# Altium schematic sheet Main sheet.SchDoc
size A3
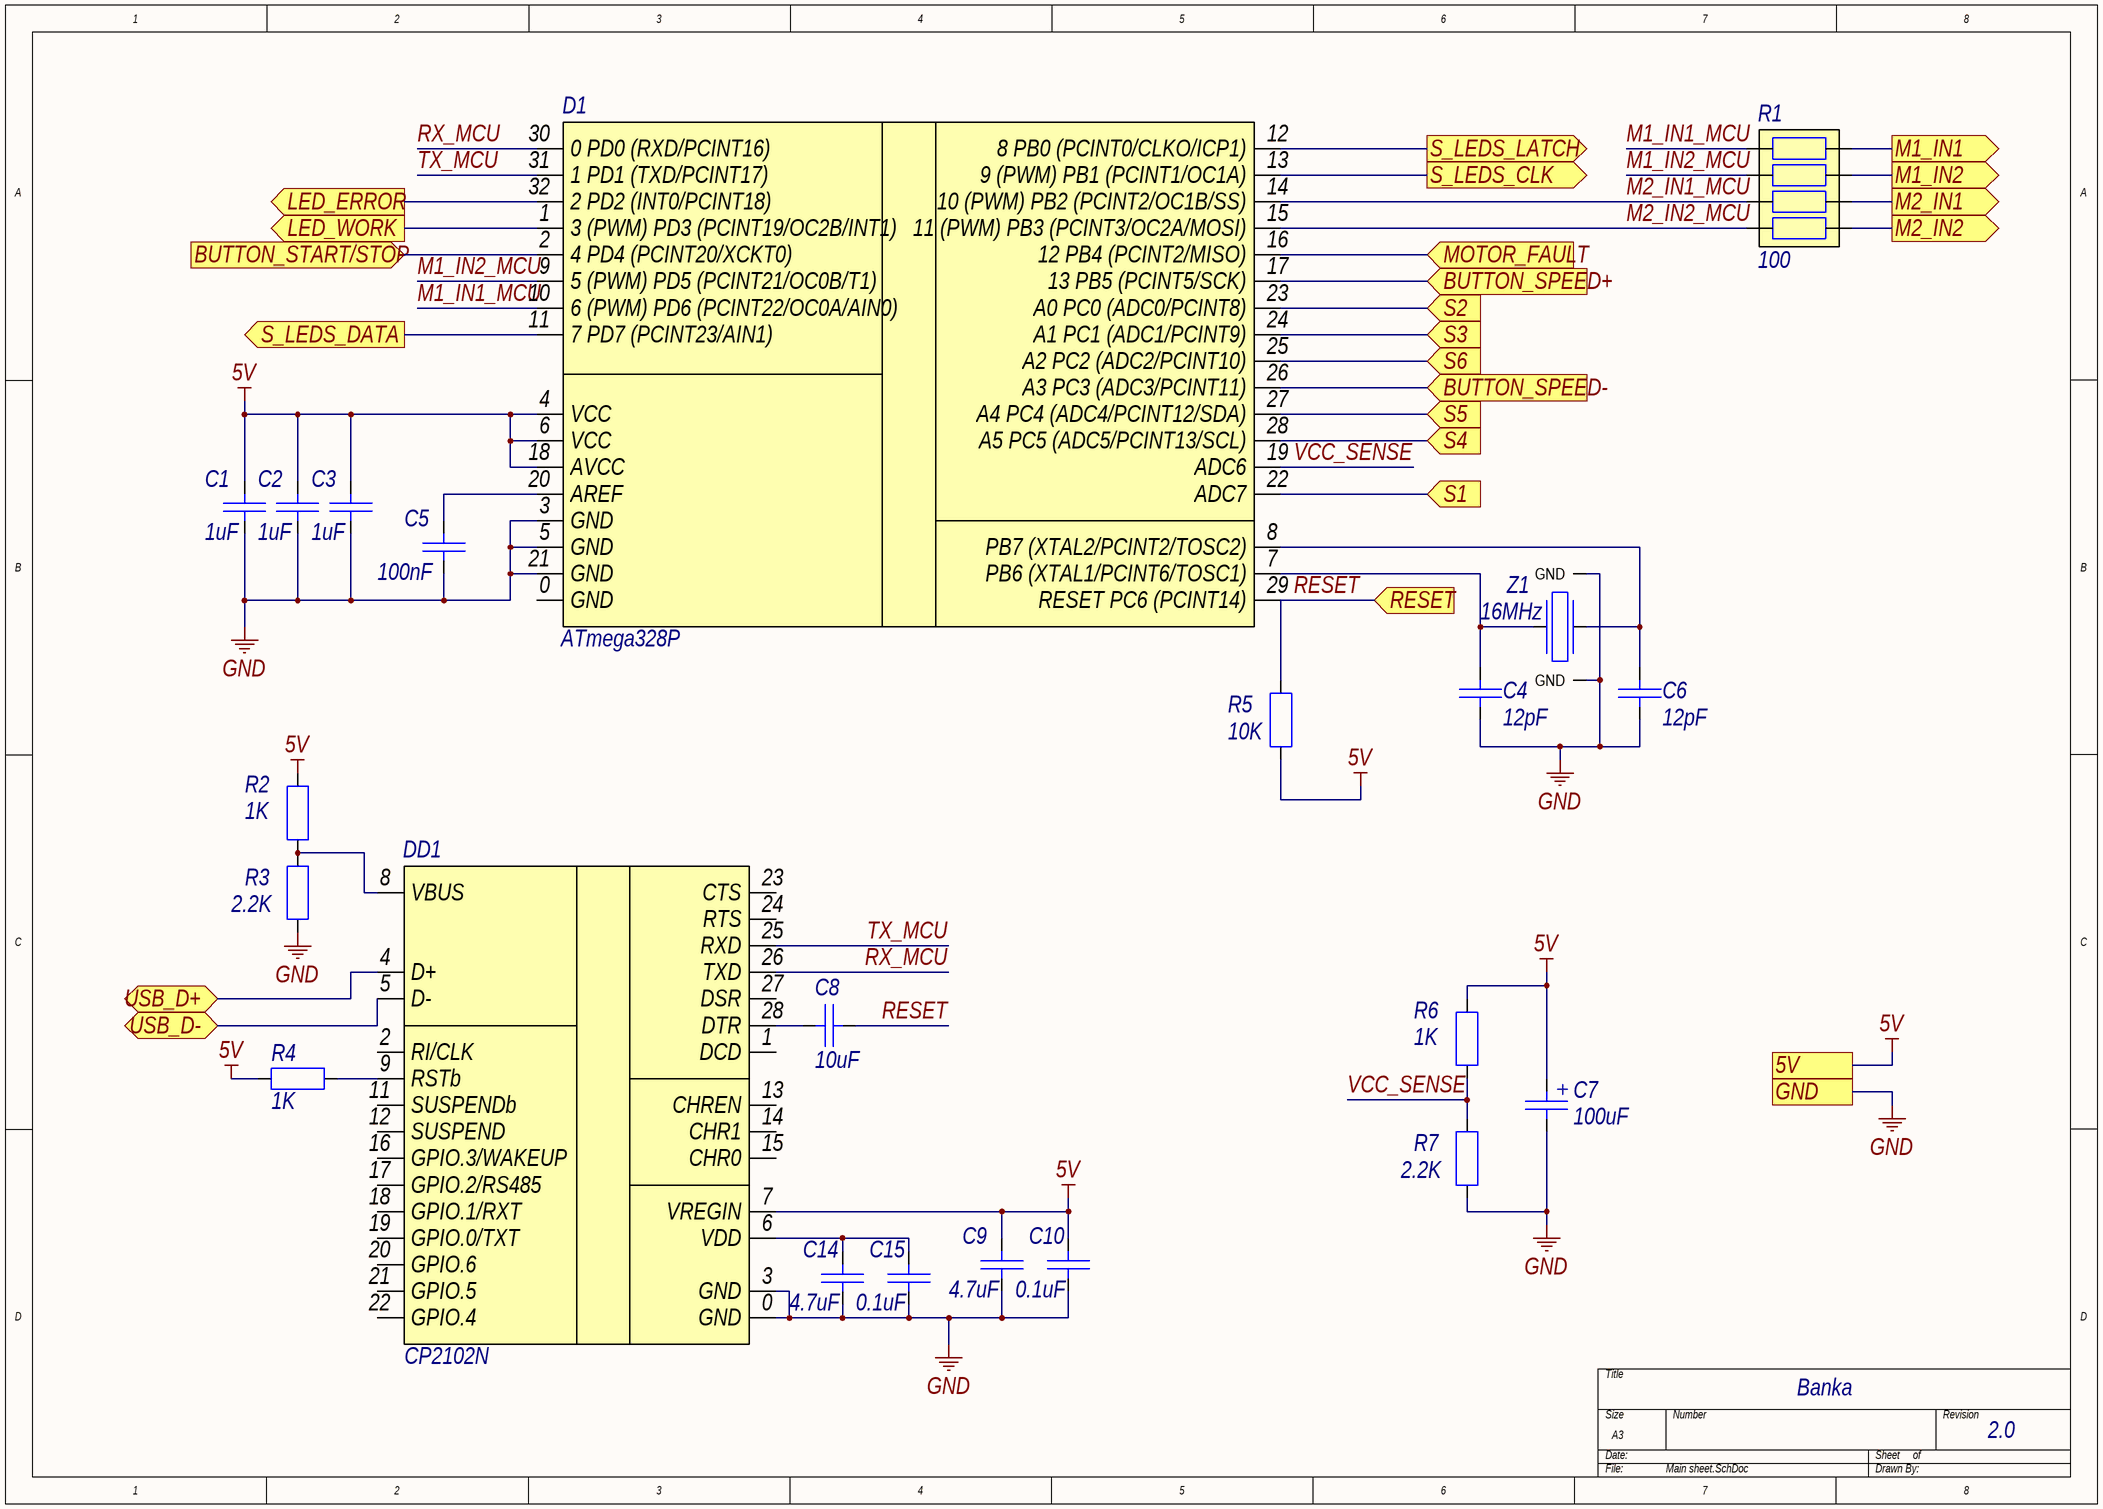
[diagram p0: Main sheet.SchDoc]

## Parts
C1  1uF  [NPC0805]
C2  1uF  [NPC0805]
C3  1uF  [NPC0805]
C4  12pF  [NPC0805]
C5  100nF  [NPC0805]
C6  12pF  [NPC0805]
C7  100uF  [TANTAL CAPACITOR C]
C8  10uF  [NPC0805]
C9  4.7uF  [NPC0805]
C10  0.1uF  [NPC0805]
C14  4.7uF  [NPC0805]
C15  0.1uF  [NPC0805]
D1  ATmega328P  [TQFP32]
DD1  CP2102N  [QFN28 (5x5)]
R1  100  [CAT16]
R2  1K  [R0805]
R3  2.2K  [R0805]
R4  1K  [R0805]
R5  10K  [R0805]
R6  1K  [R0805]
R7  2.2K  [R0805]
Z1  16MHz  [KX-7T]

## Ports
5V, BUTTON_SPEED+ (in), BUTTON_SPEED- (in), BUTTON_START/STOP (in), GND, LED_ERROR (out), LED_WORK (out), M1_IN1 (out), M1_IN2 (out), M2_IN1 (out), M2_IN2 (out), MOTOR_FAULT (in), RESET (in), S1 (in), S2 (in), S3 (in), S4 (in), S5 (in), S6 (in), S_LEDS_CLK (out), S_LEDS_DATA (out), S_LEDS_LATCH (out), USB_D+ (bidir), USB_D- (bidir)

## Nets
5V: C1.2 C2.2 C3.2 C7.1 C9.2 C10.2 D1.4(VCC) D1.6(VCC) D1.18(AVCC) DD1.7(VREGIN) R2.2 R4.2 R5.1 R6.2 ; port 5V
GND: C1.1 C2.1 C3.1 C4.1 C5.1 C6.1 C7.2 C9.1 C10.1 C14.1 C15.1 D1.3(GND) D1.5(GND) D1.21(GND) DD1.0(GND) DD1.3(GND) R3.1 R7.1 Z1.3(GND) Z1.4(GND) ; port GND
BUTTON_SPEED+: D1.17(13_PB5_(PCINT5/SCK)) ; port BUTTON_SPEED+
BUTTON_SPEED-: D1.26(A3_PC3_(ADC3/PCINT11)) ; port BUTTON_SPEED-
BUTTON_START/STOP: D1.2(4_PD4_(PCINT20/XCKT0)) ; port BUTTON_START/STOP
LED_ERROR: D1.32(2_PD2_(INT0/PCINT18)) ; port LED_ERROR
LED_WORK: D1.1(3_(PWM)_PD3_(PCINT19/OC2B/INT1)) ; port LED_WORK
M1_IN1: R1.4 ; port M1_IN1
M1_IN1_MCU: D1.10(6_(PWM)_PD6_(PCINT22/OC0A/AIN0)) R1.5
M1_IN2: R1.3 ; port M1_IN2
M1_IN2_MCU: D1.9(5_(PWM)_PD5_(PCINT21/OC0B/T1)) R1.6
M2_IN1: R1.2 ; port M2_IN1
M2_IN1_MCU: D1.14(10_(PWM)_PB2_(PCINT2/OC1B/SS)) R1.7
M2_IN2: R1.1 ; port M2_IN2
M2_IN2_MCU: D1.15(11_(PWM)_PB3_(PCINT3/OC2A/MOSI)) R1.8
MOTOR_FAULT: D1.16(12_PB4_(PCINT2/MISO)) ; port MOTOR_FAULT
RESET: C8.1 D1.29(RESET_PC6_(PCINT14)) R5.2 ; port RESET
RX_MCU: D1.30(0_PD0_(RXD/PCINT16)) DD1.26(TXD)
S1: D1.22(ADC7) ; port S1
S2: D1.23(A0_PC0_(ADC0/PCINT8)) ; port S2
S3: D1.24(A1_PC1_(ADC1/PCINT9)) ; port S3
S4: D1.28(A5_PC5_(ADC5/PCINT13/SCL)) ; port S4
S5: D1.27(A4_PC4_(ADC4/PCINT12/SDA)) ; port S5
S6: D1.25(A2_PC2_(ADC2/PCINT10)) ; port S6
S_LEDS_CLK: D1.13(9_(PWM)_PB1_(PCINT1/OC1A)) ; port S_LEDS_CLK
S_LEDS_DATA: D1.11(7_PD7_(PCINT23/AIN1)) ; port S_LEDS_DATA
S_LEDS_LATCH: D1.12(8_PB0_(PCINT0/CLKO/ICP1)) ; port S_LEDS_LATCH
TX_MCU: D1.31(1_PD1_(TXD/PCINT17)) DD1.25(RXD)
USB_D+: DD1.4(D+) ; port USB_D+
USB_D-: DD1.5(D-) ; port USB_D-
VCC_SENSE: D1.19(ADC6) R6.1 R7.2
NetC4_2: C4.2 D1.7(PB6_(XTAL1/PCINT6/TOSC1)) Z1.1
NetC5_2: C5.2 D1.20(AREF)
NetC6_2: C6.2 D1.8(PB7_(XTAL2/PCINT2/TOSC2)) Z1.2
NetC8_2: C8.2 DD1.28(DTR)
NetC14_2: C14.2 C15.2 DD1.6(VDD)
NetDD1_8: DD1.8(VBUS) R2.1 R3.2
NetDD1_9: DD1.9(RSTb) R4.1

Not connected (* = marked no-connect by the designer): D1 0(GND); DD1 1(DCD) 2(RI/CLK) 11(SUSPENDb) 12(SUSPEND) 13(CHREN) 14(CHR1) 15(CHR0) 16(GPIO.3/WAKEUP) 17(GPIO.2/RS485) 18(GPIO.1/RXT) 19(GPIO.0/TXT) 20(GPIO.6) 21(GPIO.5) 22(GPIO.4) 23(CTS) 24(RTS) 27(DSR)

## Notes on the sheet
- Banka
- 2.0

## Library data of the parts
C1-C6 C8-C10 C14 C15 = Nonpolarized Capacitor: Nonpolarized Capacitor (Ceramic)
  C1-C3: Value: 1uF
  C4 C6: Value: 12pF
  C5: Value: 100nF
  C8: Value: 10uF
  C9 C14: Value: 4.7uF
  C10 C15: Value: 0.1uF
C7 = Polarized Capacitor: Polarized Capacitor (Electrolytic, tantalum); Value: 100uF
D1 = ATmega328P: AVR, 8-bit MCU, 20MHz, 32KB Flash
DD1 = CP2102N 28 pin: USB-UART converter
R1 = Resistor Array: Power rating: 0,05Вт; Value: 100
R2-R7 = Resistor: Power rating: 2Вт
  R2 R4 R6: Value: 1K
  R3 R7: Value: 2.2K
  R5: Value: 10K
Z1 = Quartz Crystal: Quartz oscillator; Manufacturer: Geyer Electronics; Tolerance: 30ppm; Temperature tolerance: 100ppm; Max. aging frequency at first year: +-2ppm; Name: KX-7T; Temperature range: -40...85C; Value: 16MHz; Package: SMD3,2x2,5x0,8